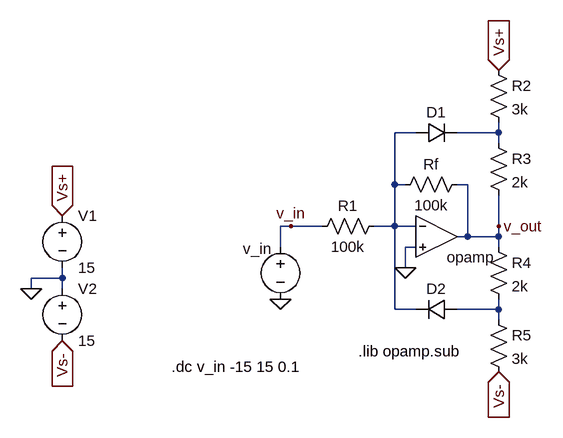
[diagram p0: schematic voltage_limiter_soft_opamp.asc]
voltage_limiter_soft_opamp.asc, the LTspice schematic file:
Version 4
SHEET 1 880 680
WIRE 192 16 160 16
WIRE 320 16 320 0
WIRE 320 16 256 16
WIRE 320 32 320 16
WIRE 160 96 160 16
WIRE 176 96 160 96
WIRE 272 96 256 96
WIRE 0 160 -16 160
WIRE 48 160 0 160
WIRE 160 160 160 96
WIRE 160 160 128 160
WIRE 192 160 160 160
WIRE 320 160 320 112
WIRE 272 176 272 96
WIRE 272 176 256 176
WIRE 320 176 320 160
WIRE 320 176 272 176
WIRE -16 192 -16 160
WIRE 192 192 176 192
WIRE 320 192 320 176
WIRE 176 224 176 192
WIRE -352 240 -352 224
WIRE -352 240 -400 240
WIRE -400 256 -400 240
WIRE -352 256 -352 240
WIRE 160 288 160 160
WIRE 192 288 160 288
WIRE 320 288 320 272
WIRE 320 288 256 288
WIRE 320 304 320 288
FLAG 176 224 0
FLAG -16 272 0
FLAG 320 -80 Vs+
IOPIN 320 -80 In
FLAG 320 384 Vs-
IOPIN 320 384 In
FLAG -400 256 0
FLAG -352 144 Vs+
IOPIN -352 144 In
FLAG -352 336 Vs-
IOPIN -352 336 In
FLAG 0 160 v_in
FLAG 320 160 v_out
SYMBOL OpAmps\\opamp 224 112 R0
WINDOW 0 0 32 Invisible 2
SYMATTR InstName U1
SYMBOL res 272 80 R90
WINDOW 0 0 56 VBottom 2
WINDOW 3 32 56 VTop 2
SYMATTR InstName Rf
SYMATTR Value 100k
SYMBOL diode 192 32 R270
WINDOW 0 32 32 VTop 2
WINDOW 3 0 32 Invisible 2
SYMATTR InstName D1
SYMBOL res 144 144 R90
WINDOW 0 0 56 VBottom 2
WINDOW 3 32 56 VTop 2
SYMATTR InstName R1
SYMATTR Value 100k
SYMBOL voltage -16 176 R0
WINDOW 0 -58 19 Left 2
WINDOW 3 -210 80 Left 2
WINDOW 123 0 0 Left 0
WINDOW 39 0 0 Left 0
SYMATTR InstName v_in
SYMATTR Value ""
SYMBOL res 304 16 R0
SYMATTR InstName R3
SYMATTR Value 2k
SYMBOL res 304 -96 R0
SYMATTR InstName R2
SYMATTR Value 3k
SYMBOL diode 256 272 R90
WINDOW 0 0 32 VBottom 2
WINDOW 3 32 32 Invisible 2
SYMATTR InstName D2
SYMBOL res 304 176 R0
SYMATTR InstName R4
SYMATTR Value 2k
SYMBOL res 304 288 R0
SYMATTR InstName R5
SYMATTR Value 3k
SYMBOL voltage -352 128 R0
WINDOW 123 0 0 Left 0
WINDOW 39 0 0 Left 0
SYMATTR InstName V1
SYMATTR Value 15
SYMBOL voltage -352 240 R0
WINDOW 123 0 0 Left 0
WINDOW 39 0 0 Left 0
SYMATTR InstName V2
SYMATTR Value 15
TEXT 104 352 Left 2 !.lib opamp.sub
TEXT -184 376 Left 2 !.dc v_in -15 15 0.1

The netlist it stands for:
* voltage_limiter_soft_opamp.asc
XU1 N001 0 v_out opamp Aol=100K GBW=10Meg  ; pins invin noninvin out
Rf v_out N001 100k
D1 N001 N002 D
R1 N001 v_in 100k
v_in v_in 0
R3 N002 v_out 2k
R2 Vs+ N002 3k
D2 N003 N001 D
R4 v_out N003 2k
R5 N003 Vs- 3k
V1 Vs+ 0 15
V2 0 Vs- 15
.model D D
.lib standard.dio
.lib opamp.sub
.dc v_in -15 15 0.1
.backanno
.end